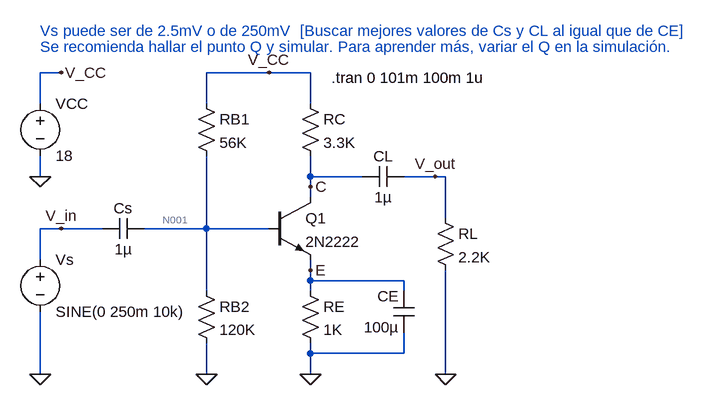
[diagram p0: schematic ejercicio-02_10_19B.asc]
ejercicio-02_10_19B.asc, the LTspice schematic file:
Version 4
SHEET 1 960 680
WIRE -64 -416 -96 -416
WIRE 256 -416 160 -416
WIRE 320 -416 256 -416
WIRE -96 -368 -96 -416
WIRE 160 -368 160 -416
WIRE 320 -368 320 -416
WIRE -96 -256 -96 -288
WIRE 320 -256 320 -288
WIRE 400 -256 320 -256
WIRE 512 -256 464 -256
WIRE 528 -256 512 -256
WIRE 320 -240 320 -256
WIRE 320 -224 320 -240
WIRE 528 -192 528 -256
WIRE -64 -176 -96 -176
WIRE 0 -176 -64 -176
WIRE 160 -176 160 -288
WIRE 160 -176 64 -176
WIRE 256 -176 160 -176
WIRE -96 -128 -96 -176
WIRE 320 -112 320 -128
WIRE 320 -96 320 -112
WIRE 464 -96 320 -96
WIRE 160 -80 160 -176
WIRE 320 -80 320 -96
WIRE 464 -80 464 -96
WIRE 320 16 320 0
WIRE 464 16 464 -16
WIRE 464 16 320 16
WIRE -96 48 -96 -48
WIRE 160 48 160 0
WIRE 320 48 320 16
WIRE 528 48 528 -112
FLAG -96 48 0
FLAG 160 48 0
FLAG 320 48 0
FLAG 528 48 0
FLAG 256 -416 V_CC
FLAG -64 -416 V_CC
FLAG -96 -256 0
FLAG -64 -176 V_in
FLAG 512 -256 V_out
FLAG 320 -240 C
FLAG 320 -112 E
SYMBOL cap 64 -192 R90
WINDOW 0 0 32 VBottom 2
WINDOW 3 32 32 VTop 2
SYMATTR InstName Cs
SYMATTR Value 1µ
SYMBOL cap 464 -272 R90
WINDOW 0 0 32 VBottom 2
WINDOW 3 32 32 VTop 2
SYMATTR InstName CL
SYMATTR Value 1µ
SYMBOL cap 480 -16 R180
WINDOW 0 24 56 Left 2
WINDOW 3 24 8 Left 2
SYMATTR InstName CE
SYMATTR Value 100µ
SYMBOL res 144 -384 R0
SYMATTR InstName RB1
SYMATTR Value 56K
SYMBOL res 304 -384 R0
SYMATTR InstName RC
SYMATTR Value 3.3K
SYMBOL res 144 -96 R0
SYMATTR InstName RB2
SYMATTR Value 120K
SYMBOL res 512 -208 R0
SYMATTR InstName RL
SYMATTR Value 2.2K
SYMBOL voltage -96 -144 R0
WINDOW 123 0 0 Left 0
WINDOW 39 0 0 Left 0
SYMATTR InstName Vs
SYMATTR Value SINE(0 250m 10k)
SYMBOL npn 256 -224 R0
SYMATTR InstName Q1
SYMATTR Value 2N2222
SYMBOL res 304 -96 R0
SYMATTR InstName RE
SYMATTR Value 1K
SYMBOL voltage -96 -384 R0
WINDOW 123 0 0 Left 0
WINDOW 39 0 0 Left 0
SYMATTR InstName VCC
SYMATTR Value 18
TEXT 352 -408 Left 2 !.tran 0 101m 100m 1u
TEXT -96 -480 Left 2 ;Vs puede ser de 2.5mV o de 250mV
TEXT -96 -456 Left 2 ;Se recomienda hallar el punto Q y simular. Para aprender más, variar el Q en la simulación.
TEXT 304 -480 Left 2 ;[Buscar mejores valores de Cs y CL al igual que de CE]

The netlist it stands for:
* ejercicio-02_10_19B.asc
Cs N001 V_in 1µ
CL V_out C 1µ
CE 0 E 100µ
RB1 V_CC N001 56K
RC V_CC C 3.3K
RB2 N001 0 120K
RL V_out 0 2.2K
Vs V_in 0 SINE(0 250m 10k)
Q1 C N001 E 0 2N2222
RE E 0 1K
VCC V_CC 0 18
.model NPN NPN
.model PNP PNP
.lib standard.bjt
.tran 0 101m 100m 1u
* Vs puede ser de 2.5mV o de 250mV
* Se recomienda hallar el punto Q y simular. Para aprender más, variar el Q en la simulación.
* [Buscar mejores valores de Cs y CL al igual que de CE]
.backanno
.end

* Results of the author's LTspice run, read from the files saved beside the schematic
* Operating Point, zero values left out:
*   V(n001) = 5.017 V
*   V(c) = 4.379 V
*   V(e) = 4.318 V
*   V(v_cc) = 18 V
*   Ic(Q1) = 4.128 mA
*   Ib(Q1) = 190 µA
*   Ie(Q1) = -4.318 mA
*   I(Re) = 4.318 mA
*   I(Rb2) = 41.81 µA
*   I(Rc) = 4.128 mA
*   I(Rb1) = 231.8 µA
*   I(Vcc) = -4.359 mA
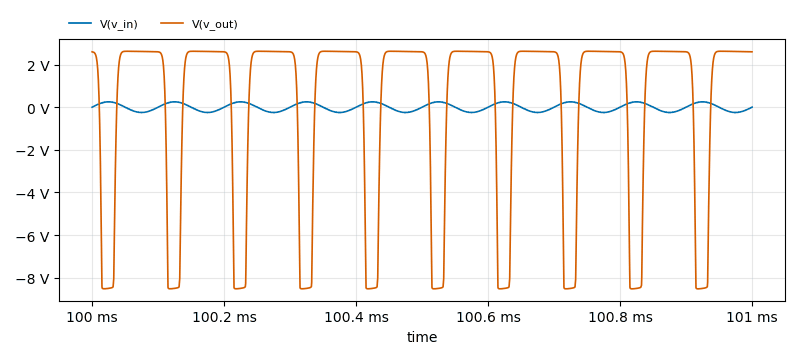
[diagram p1: Transient Analysis of ejercicio-02_10_19B.asc, plotted from the saved traces]
* Transient Analysis, 1 run:
*   V(v_in): min -250 mV, max 250 mV, average 65.91 µV, rms 176.7 mV, last 0 V
*   V(v_out): min -8.518 V, max 2.623 V, average -17.71 mV, rms 4.372 V, last 2.596 V